# Altium schematic sheet IMU.SchDoc
size A; SheetNumber: 1; SheetTotal: 1
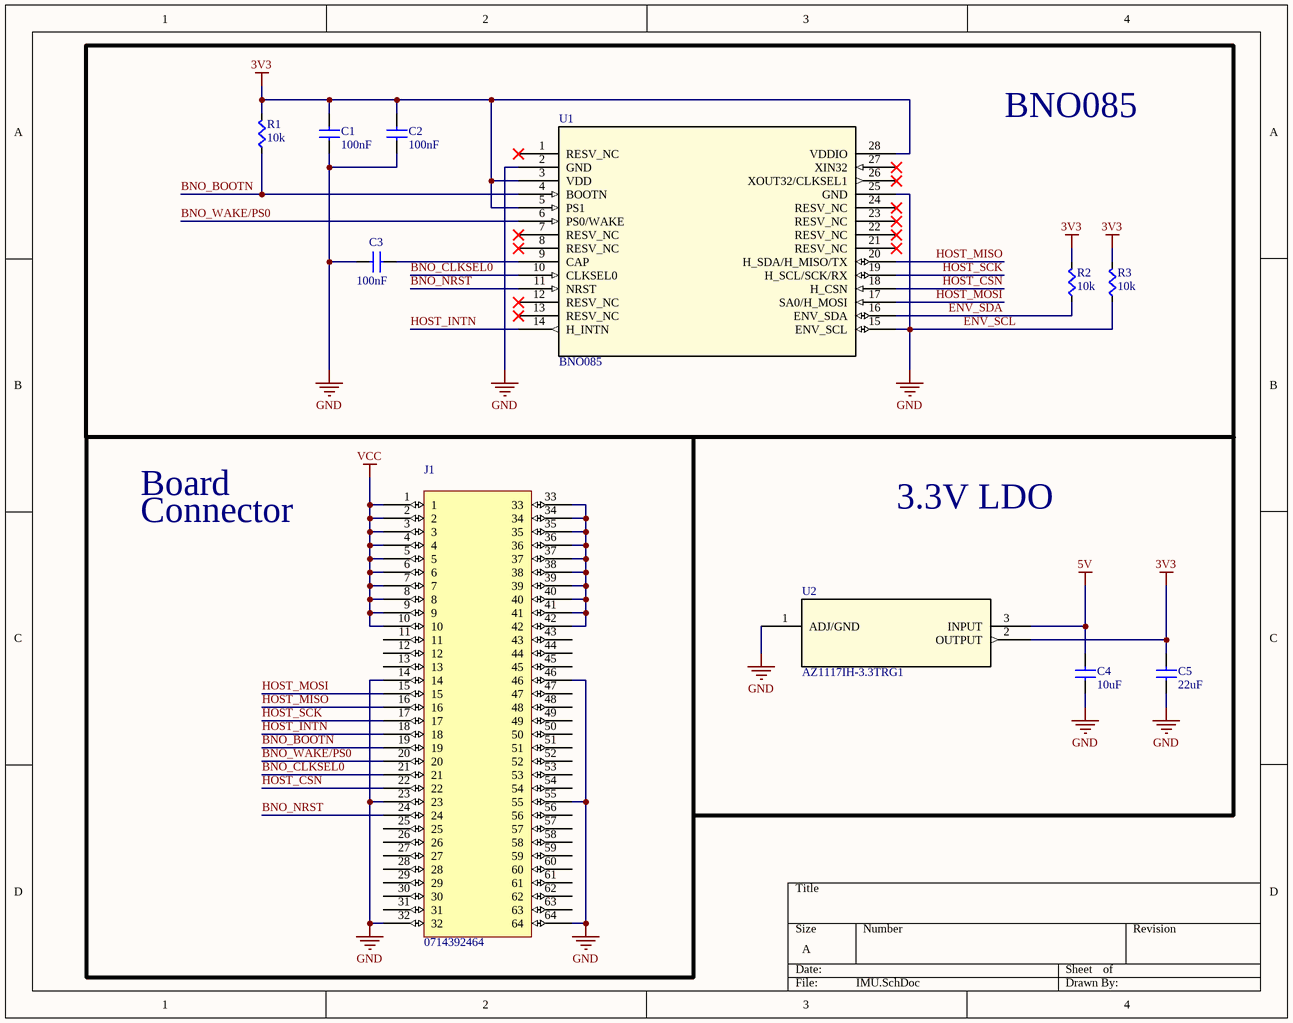
[diagram p0: IMU.SchDoc]

## Parts
C1  value 100nF  [CAPC0603]  (hidden comment: Cap)
C2  value 100nF  [CAPC0603]  (hidden comment: Cap)
C3  value 100nF  [CAPC0603]  (hidden comment: Cap)
C4  value 10uF  [CAPC0805]  (hidden comment: Cap)
C5  value 22uF  [CAPC0603]  (hidden comment: Cap)
J1  0714392464  [0714392464]
R1  value 10k  [RES0603]  (hidden comment: Res)
R2  value 10k  [RES0603]  (hidden comment: Res)
R3  value 10k  [RES0603]  (hidden comment: Res)
U1  BNO085  [LGA28_5.2X3.8_CEV]
U2  AZ1117IH-3.3TRG1  [SOT223_AZ1117I_6P5X3P5_DIO]

## Nets
3V3: C1.1(A) C2.1(A) C5.1(A) R1.1(A) R2.1(A) R3.1(A) U1.3(VDD) U1.5(PS1) U1.28(VDDIO) U2.2(OUTPUT)
5V: C4.1(A) U2.3(INPUT)
ENV_SCL: C1.2(B) C2.2(B) C3.1(A) C4.2(B) C5.2(B) J1.14 J1.23 J1.32 J1.46 J1.55 J1.64 R3.2(B) U1.2(GND) U1.15(ENV_SCL) U1.25(GND) U2.1(ADJ/GND)  [also labelled GND]
VCC: J1.1 J1.2 J1.3 J1.4 J1.5 J1.6 J1.7 J1.8 J1.9 J1.10
BNO_BOOTN: J1.19 R1.2(B) U1.4(BOOTN)
BNO_CLKSEL0: J1.21 U1.10(CLKSEL0)
BNO_NRST: J1.24 U1.11(NRST)
BNO_WAKE/PS0: J1.20 U1.6(PS0/WAKE)
ENV_SDA: R2.2(B) U1.16(ENV_SDA)
HOST_CSN: J1.22 U1.18(H_CSN)
HOST_INTN: J1.18 U1.14(H_INTN)
HOST_MISO: J1.16 U1.20(H_SDA/H_MISO/TX)
HOST_MOSI: J1.15 U1.17(SA0/H_MOSI)
HOST_SCK: J1.17 U1.19(H_SCL/SCK/RX)
NetC3_2: C3.2(B) U1.9(CAP)
NetJ1_33: J1.33 J1.34 J1.35 J1.36 J1.37 J1.38 J1.39 J1.40 J1.41 J1.42

Not connected (* = marked no-connect by the designer): J1 11 12 13 25 26 27 28 29 30 31 43 44 45 47 48 49 50 51 52 53 54 56 57 58 59 60 61 62 63; U1 1(RESV_NC)* 7(RESV_NC)* 8(RESV_NC)* 12(RESV_NC)* 13(RESV_NC)* 21(RESV_NC)* 22(RESV_NC)* 23(RESV_NC)* 24(RESV_NC)* 26(XOUT32/CLKSEL1)* 27(XIN32)*

## Notes on the sheet
- BNO085
- Board
- Connector
- 3.3V LDO

## Library data of the parts
J1 = 0714392464: 64 Position Connector Receptacle, Outer Shroud Contacts Surface Mount Gold
U1 = BNO085: No Description Available; Mfr_Name: CEVA; Copyright: Copyright (C) 2023 Ultra Librarian. All rights reserved.; Manufacturer_Part_Number: BNO085; RefDes: RefDes; Type: DEV
U2 = AZ1117IH-3.3TRG1: No Description Available; Mfr_Name: Diodes Inc; Copyright: Copyright (C) 2023 Ultra Librarian. All rights reserved.; Manufacturer_Part_Number: AZ1117IH-3.3TRG1; RefDes: RefDes; Type: DEV
C1-C5 = Cap: Supplier 1: Digi-Key; Supplier Part Number 1: 1276-1000-1-ND
R1-R3 = Res: Supplier 1: Digi-Key; Supplier Part Number 1: RMCF0603JT10K0CT-ND